# EAGLE design GSRmeter (EAGLE 7.4.0)
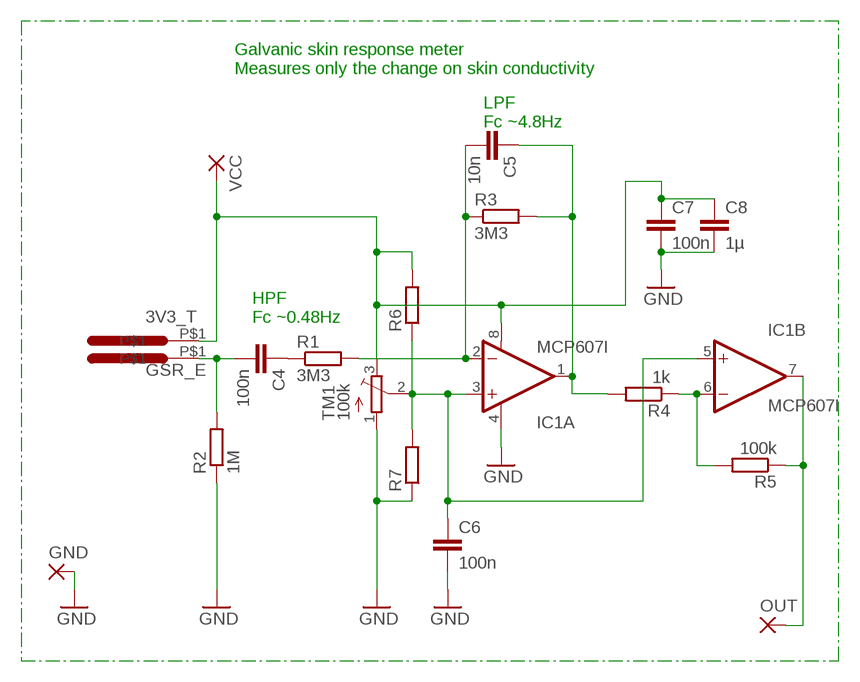
[diagram p0: schematic, sheet 1]

## Parts
C4  100n  C-EUC0603K  [C0603K]
C5  10n  C-EUC0603K  [C0603K]
C6  100n  C-EUC0603K  [C0603K]
C7  100n  C-EUC0603K  [C0603K]
C8  1µ  C-EUC0603K  [C0603K]
GND  SMD5  [SMD2,54-5,08]
IC1  MCP607I  OPAMP-DUALU  [SO08]
OUT  SMD5  [SMD2,54-5,08]
R1  3M3  R-EU_R0603  [R0603]
R2  1M  R-EU_R0603  [R0603]
R3  3M3  R-EU_R0603  [R0603]
R4  1k  R-EU_R0603  [R0603]
R5  100k  R-EU_R0603  [R0603]
R6  R-EU_R0402  [R0402]
R7  R-EU_R0402  [R0402]
TM1  100k  TRIMPOTTC33X  [TC33X]
U$1  ELECTRODE  [ELECTRODE]
U$2  ELECTRODE  [ELECTRODE]
VCC  SMD5  [SMD2,54-5,08]

## Nets
3V3_T: C7.1 C8.1 IC1.8(A:V+) R6.2 TM1.3(E) U$1.P$1 VCC.1(P)
GND: C6.2 C7.2 C8.2 GND.1(P) IC1.4(A:V-) R2.1 R7.1 TM1.1(A)
GSR_E: C4.2 R2.2 U$2.P$1
N$15: C5.2 IC1.2(A:-IN) R1.2 R3.1
N$16: C5.1 IC1.1(A:OUT) R3.2 R4.2
N$17: C6.1 IC1.3(A:+IN) IC1.5(B:+IN) R6.1 R7.2 TM1.2(S)
N$18: C4.1 R1.1
N$20: IC1.6(B:-IN) R4.1 R5.2
N$21: IC1.7(B:OUT) OUT.1(P) R5.1

## Notes on the sheet
- Galvanic skin response meter
  Measures only the change on skin conductivity
- LPF
  Fc ~4.8Hz
- HPF
  Fc ~0.48Hz

## Library data of the parts
C4-C8 = rcl:C-EU: CAPACITOR, European symbol
GND OUT VCC = wirepad:SMD5: SMD PAD
IC1 = SparkFun-AnalogIC:OPAMP-DUAL: Generic op-amp footprint
R1-R7 = rcl:R-EU_: RESISTOR, European symbol
TM1 = adafruit:TRIMPOT: SMT trimmer potentiometer part number TC33X http://www.ladyada.net/library/eagle
U$1 U$2 = electrodeGSR:ELECTRODE

## Board
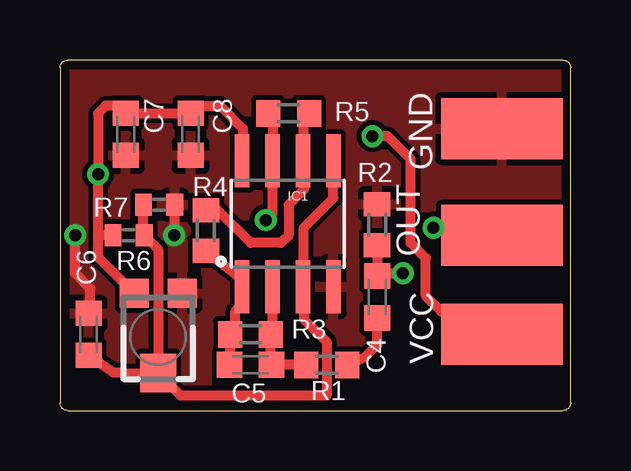
[diagram p1: board, top side]
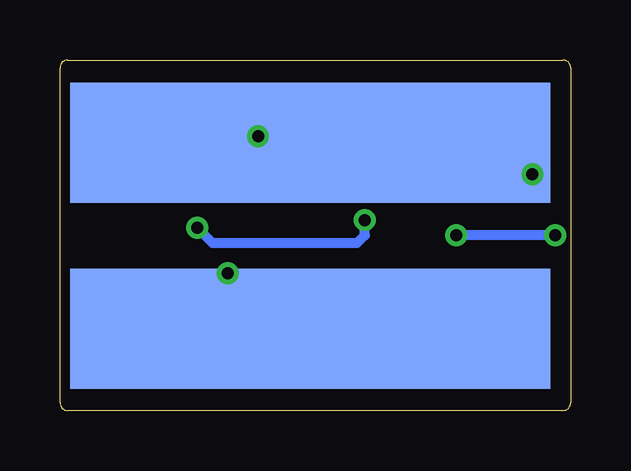
[diagram p2: board, bottom side, seen from below]

Size 21.27 x 14.6 mm. Coordinates in mm from the lower left corner, seen from the top.
Outline: 0.32,0 20.95,0 arc90 21.27,0.32 21.27,14.29 arc90 20.95,14.6 0.32,14.6 arc90 0,14.29 0,0.32 arc90 0.32,0
Copper layers (1*16): Top 0.035mm / dielectric 1.5mm / Bottom 0.035mm
Design rules "default *": minimum track width 10mil, minimum drill 24mil, track to track 8mil, track to pad 8mil, pad to pad 8mil, via to via 8mil, smd to smd 8mil, copper to edge 15mil, drill to drill 8mil, minimum pad ring 10mil, minimum via ring 8mil, stop-mask expansion 4mil, vias tented up to drill 20mil, thermal gap 10mil

### Footprints (pad centres in the part's own frame; a part is rotated, then mirrored left to right if it is on the bottom)
C0603K = smd 1.05 x 1.08: 1 -0.875,0; 2 0.875,0
SMD2,54-5,08 = smd 2.54 x 5.08: 1 0,0
SO08 = smd 0.61 x 2.21: 1 -1.905,-2.616; 2 -0.635,-2.616; 3 0.635,-2.616; 4 1.905,-2.616; 5 1.905,2.616; 6 0.635,2.616; 7 -0.635,2.616; 8 -1.905,2.616
R0603 = smd 1 x 1.1: 1 -0.85,0; 2 0.85,0
R0402 = smd 0.7 x 0.9: 1 -0.65,0; 2 0.65,0
TC33X = smd 1.2 x 1.2: 1 -1,-1.825; 3 1,-1.825 | smd 1.5 x 1.6: 2 0,1.5
ELECTRODE = smd 20 x 5: P$1 0,0

### Placement (x,y rotation side)
C4  13.22,4.73 90 top
C5  7.94,1.91 0 top
C6  1.19,3.17 90 top
C7  2.74,11.51 270 top
C8  5.44,11.51 270 top
GND  18.41,11.75 90 top
IC1  9.49,7.78 0 top
OUT  18.41,7.3 90 top
R1  11.11,1.91 180 top
R2  13.21,7.75 270 top
R3  7.94,3.18 180 top
R4  6.08,7.5 270 top
R5  9.53,12.38 0 top
R6  2.86,7.3 180 top
R7  4.13,8.57 180 top
TM1  4.09,3.06 180 top
U$1  10.84,11.16 0 bottom
U$2  10.84,3.42 0 bottom
VCC  18.41,3.18 270 top

### Tracks (layer width: path | path; a pad name or v marks a point on that pad's centre or on a via)
3V3_T  (via drill 0.5)
  Top 0.406: 7.62,10.43 IC1.8 7.59,11.4 7.62,11.43 7.62,11.75 6.67,12.7 5.45,12.7 C8.1 C7.1 2.73,12.7 1.91,12.7 1.59,12.38 v1.59,9.84 1.59,7.3 | TM1.3 1.59,6.38 1.59,7.3 | VCC.1 17.46,4.13 15.88,4.13 15.24,4.76 15.24,6.35 14.61,6.99 14.61,10.48 13.65,11.43 v13.02,11.43 | R6.2 1.59,7.3
  Bottom 0.406: v1.59,9.84 2.9,11.16 U$1.P$1 12.75,11.16 v13.02,11.43
GND  (via drill 0.5)
  Top 0.406: C6.2 1.27,4.13 1.27,5.08 0.64,5.71 v0.64,7.3 | v4.76,7.3 4.78,7.32 R7.1
  Bottom 0.406: v0.64,7.3 v4.76,7.3
  pour Top: -1.31,16.56 -1.31,-0.99 21.64,-0.99 21.64,16.56
GSR_E  (via drill 0.5)
  Top 0.406: R2.2 C4.2 13.34,5.71 v14.29,5.71
  Bottom 0.406: v14.29,5.71 14.61,4.13 14.21,3.73 U$2.P$1
N$15
  Top 0.406: IC1.2 8.86,3.19 R3.1 8.79,1.93 C5.2 R1.2
N$16
  Top 0.406: R4.2 7.59,5.46 IC1.1 7.59,4.41 7.3,4.13 7.3,3.07 R3.2 7.09,1.93 C5.1
N$17
  Top 0.406: TM1.2 5.01,0.64 11.11,0.64 11.11,2.86 10.16,3.81 10.16,5.13 IC1.3 10.16,5.2 10.16,7.62 11.39,8.85 IC1.5 | C6.1 2.22,1.59 2.54,1.59 2.57,1.56 TM1.2 | R7.2 3.48,7.33 R6.1 4.09,6.72 TM1.2
N$18
  Top 0.406: R1.1 12.7,2.22 13.22,2.74 C4.1
N$20
  Top 0.406: R5.2 10.12,12.13 IC1.6 10.16,10.36 10.16,9.21 9.53,8.57 9.53,7.3 9.21,6.99 7.94,6.99 6.57,8.35 R4.1
N$21  (via drill 0.5)
  Top 0.406: R5.1 8.86,12.2 IC1.7 8.86,8.22 v8.57,7.94 | OUT.1 18.1,7.62 v15.56,7.62
  Bottom 0.406: v15.56,7.62 14.92,6.99 8.89,6.99 8.57,7.3 v8.57,7.94